# Altium schematic sheet 5min_DIP.SchDoc
size A3; PageSetup: Record=PageOptions|CenterHorizontal=True|CenterVertical=True|PrintScale=1.00|XCorrection=1.00|YCorrection=1.00|PrintKind=1|BorderSize=5000000|LeftOffset=0|BottomOffset=0|Orientation=2|PaperLength=1000|PaperWidth=1000|Scale=100|PaperSource=7|PrintQuality=-4|MediaType=1|DitherType=10|PaperKind=A3|PrintScaleMode=1
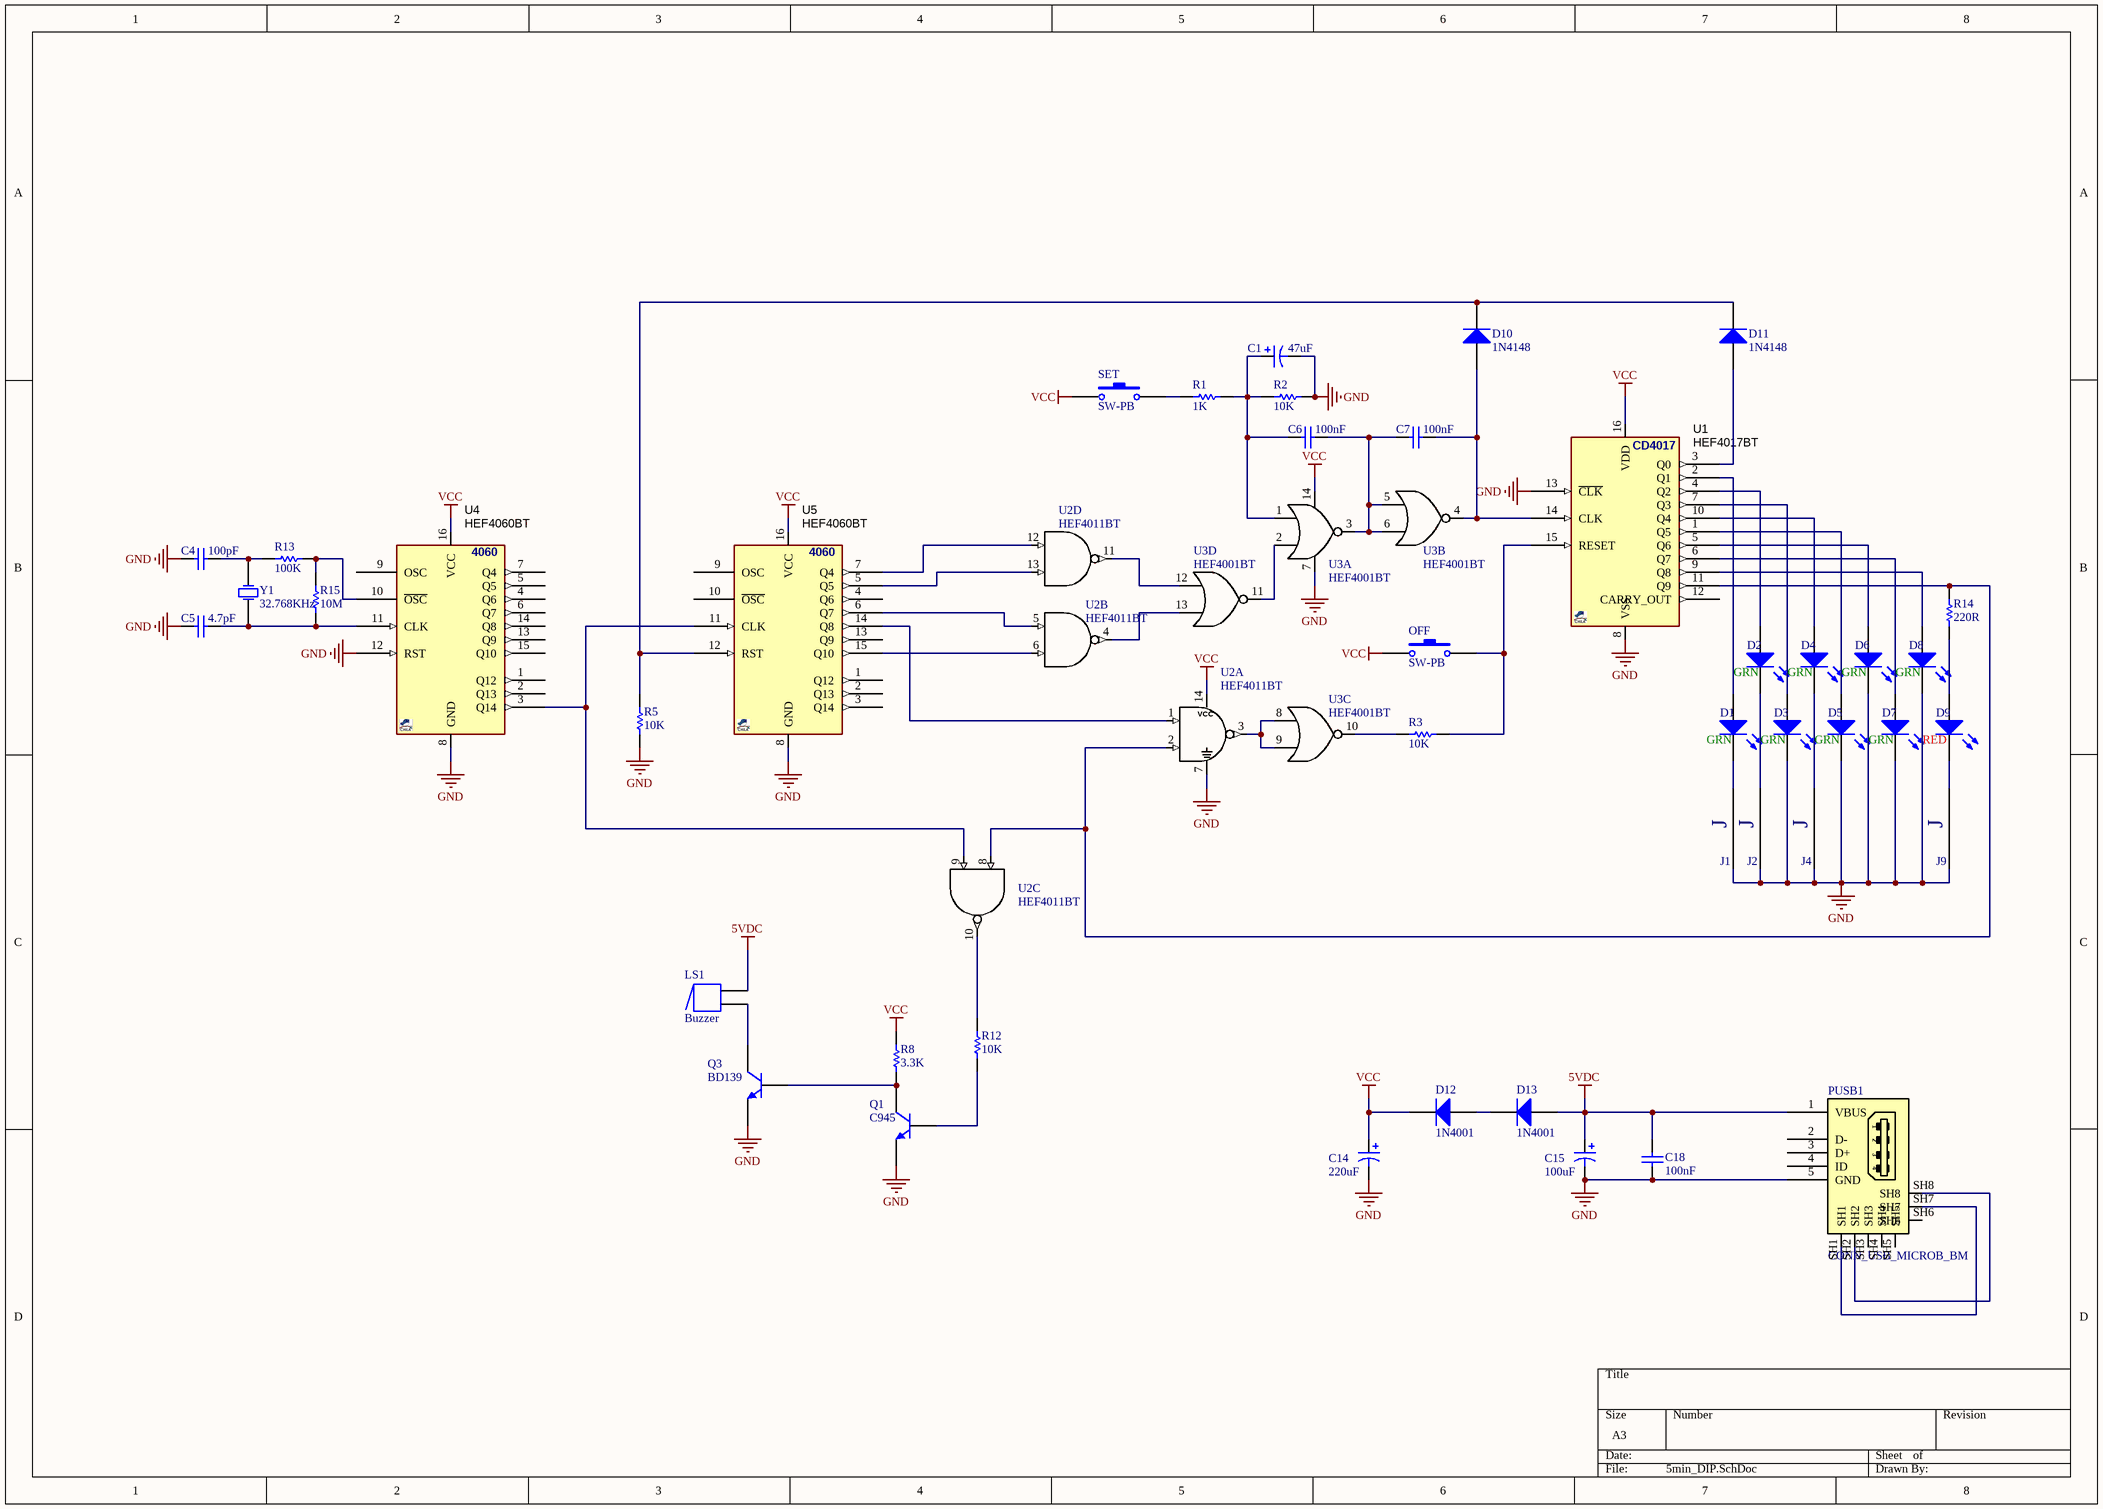
[diagram p0: 5min_DIP.SchDoc]

## Parts
C1  value 47uF  [A]  (hidden comment: Cap Pol1)
C4  value 100pF  [CAP100N]  (hidden comment: Cap)
C5  value 4.7pF  [CAP100N]  (hidden comment: Cap)
C6  value 100nF  [CAP100N]  (hidden comment: Cap)
C7  value 100nF  [CAP100N]  (hidden comment: Cap)
C14  value 220uF  [A]  (hidden comment: Cap Pol1)
C15  value 100uF  [A]  (hidden comment: Cap Pol1)
C18  value 100nF  [CAP100N]  (hidden comment: Cap)
D1  GRN  [LED3MM]
D2  GRN  [LED3MM]
D3  GRN  [LED3MM]
D4  GRN  [LED3MM]
D5  GRN  [LED3MM]
D6  GRN  [LED3MM]
D7  GRN  [LED3MM]
D8  GRN  [LED3MM]
D9  RED  [LED3MM]
D10  1N4148  [D_LN]
D11  1N4148  [D_LN]
D12  1N4001  [DO-35]
D13  1N4001  [DO-35]
J1  Jumper  [JMP]  (value not drawn)
J2  Jumper  [JMP]  (value not drawn)
J4  Jumper  [JMP]  (value not drawn)
J9  Jumper  [JMP]  (value not drawn)
LS1  Buzzer  [ABSM-1574]
OFF  SW-PB  [BUTTN]
PUSB1  CONN_USB_MICROB_BM  [USB_MICRO_AB_BM_SHS]
Q1  C945  [TO-92]
Q3  BD139  [BD139]
R1  value 1K  [AXIAL-0.3]  (hidden comment: Res1)
R2  value 10K  [AXIAL-0.3]  (hidden comment: Res1)
R3  value 10K  [AXIAL-0.3]  (hidden comment: Res1)
R5  value 10K  [AXIAL-0.3]  (hidden comment: Res1)
R8  value 3.3K  [AXIAL-0.3]  (hidden comment: Res1)
R12  value 10K  [AXIAL-0.3]  (hidden comment: Res1)
R13  value 100K  [AXIAL-0.3]  (hidden comment: Res1)
R14  value 220R  [AXIAL-0.3]  (hidden comment: Res1)
R15  value 10M  [AXIAL-0.3]  (hidden comment: Res1)
SET  SW-PB  [BUTTN]
U1  HEF4017BT  [DIP_16]
U2  HEF4011BT  [DIP_14]  (parts A,B,C,D of 4)
U3  HEF4001BT  [DIP_14]  (parts A,B,C,D of 4)
U4  HEF4060BT  [DIP_16]
U5  HEF4060BT  [DIP_16]
Y1  value 32.768KHz  [XTAL]  (hidden comment: ECS-040-20-4X-DU)

## Nets
5VDC: C15.1 C18.2 D13.1(A) LS1.1 PUSB1.1(VBUS)
GND: C1.2 C4.1 C5.1 C14.2 C15.2 C18.1 D3.2(K) D5.2(K) D6.2(K) D7.2(K) D8.2(K) J1.1 J2.1 J4.1 J9.1 PUSB1.5(GND) Q1.3(E) Q3.3(E) R2.2 R5.2 U1.8(VSS) U1.13(~{CLK}) U2.7(GND) U3.7(GND) U4.8(GND) U4.12(RST) U5.8(GND)
VCC: C14.1 D12.2(K) OFF.1 R8.2 SET.2 U1.16(VDD) U2.14(VDD) U3.14(VCC) U4.16(VCC) U5.16(VCC)
NetC1_1: C1.1 C6.1 R1.2 R2.1 U3.1
NetC4_2: C4.2 R13.1 Y1.1(OSC1)
NetC5_2: C5.2 R15.1 U4.11(CLK) Y1.2(OSC2)
NetC6_2: C6.2 C7.1 U3.3 U3.5 U3.6
NetC7_2: C7.2 D10.1(A) U1.14(CLK) U3.4
NetD1_1: D1.1(A) U1.2(Q1)
NetD1_2: D1.2(K) J1.2
NetD2_1: D2.1(A) U1.4(Q2)
NetD2_2: D2.2(K) J2.2
NetD3_1: D3.1(A) U1.7(Q3)
NetD4_1: D4.1(A) U1.10(Q4)
NetD4_2: D4.2(K) J4.2
NetD5_1: D5.1(A) U1.1(Q5)
NetD6_1: D6.1(A) U1.5(Q6)
NetD7_1: D7.1(A) U1.6(Q7)
NetD8_1: D8.1(A) U1.9(Q8)
NetD9_1: D9.1(A) R14.1
NetD9_2: D9.2(K) J9.2
NetD10_2: D10.2(K) D11.2(K) R5.1 U5.12(RST)
NetD11_1: D11.1(A) U1.3(Q0)
NetD12_1: D12.1(A) D13.2(K)
NetLS1_2: LS1.2 Q3.1(C)
NetOFF_2: OFF.2 R3.2 U1.15(RESET)
NetPUSB1_SH1: PUSB1.SH1 PUSB1.SH7
NetPUSB1_SH2: PUSB1.SH2 PUSB1.SH8
NetQ1_1: Q1.1(C) Q3.2(B) R8.1
NetQ1_2: Q1.2(B) R12.2
NetR1_1: R1.1 SET.1
NetR3_1: R3.1 U3.10
NetR12_1: R12.1 U2.10(J)
NetR13_2: R13.2 R15.2 U4.10(~{OSC})
NetR14_2: R14.2 U1.11(Q9) U2.2(B) U2.8(A)
NetU2_1: U2.1(A) U5.14(Q8)
NetU2_3: U2.3(J) U3.8 U3.9
NetU2_4: U2.4(J) U3.13
NetU2_5: U2.5(A) U5.6(Q7)
NetU2_6: U2.6(B) U5.15(Q10)
NetU2_9: U2.9(F) U4.3(Q14) U5.11(CLK)
NetU2_11: U2.11(J) U3.12
NetU2_12: U2.12(A) U5.7(Q4)
NetU2_13: U2.13(B) U5.5(Q5)
NetU3_2: U3.2 U3.11

Not connected (* = marked no-connect by the designer): PUSB1 2(D-) 3(D+) 4(ID) SH3 SH4 SH5 SH6; U1 12(CARRY_OUT); U4 1(Q12) 2(Q13) 4(Q6) 5(Q5) 6(Q7) 7(Q4) 9(OSC) 13(Q9) 14(Q8) 15(Q10); U5 1(Q12) 2(Q13) 3(Q14) 4(Q6) 9(OSC) 10(~{OSC}) 13(Q9)

## Notes on the sheet
- (in symbol CD4017_DIP16) CD4017
- (in symbol CD4060_DIP16) 4060
- (in symbol Jumper) J
- (in symbol NANDx4_CD4011BCM, part A) VCC

## Library data of the parts
C1 C14 C15 = Cap Pol1: Polarized Capacitor (Radial); Published: 8-Jun-2000; LatestRevisionDate: 17-Jul-2002; LatestRevisionNote: Re-released for DXP Platform.; PackageReference: RB7.6-15; Publisher: Altium Limited
C4-C7 C18 = Cap: Capacitor; Published: 8-Jun-2000; LatestRevisionDate: 17-Jul-2002; LatestRevisionNote: Re-released for DXP Platform.; PackageReference: RAD-0.3; Publisher: Altium Limited
D1-D9 = LED0: Typical INFRARED GaAs LED; Published: 8-Jun-2000; LatestRevisionDate: 08-Jul-2005; LatestRevisionNote: Mech Layer 1 removed.; PackageReference: LED-0; Publisher: Altium Limited
D10-D13 = Diode 1N4148: High Conductance Fast Diode; Published: 8-Jun-2000; LatestRevisionDate: 17-Jul-2002; LatestRevisionNote: Re-released for DXP Platform.; DatasheetDocument: 1997; PackageReference: DO-35; Publisher: Altium Limited; Code_JEDEC: DO-204-AH; ComponentLink1Description: Manufacturer Link; ComponentLink1URL: http://www.fairchildsemi.com/; ComponentLink2Description: Datasheet; ComponentLink2URL: http://www.fairchildsemi.com/ds/1N%2F1N4148.pdf
LS1 = Buzzer: Magnetic Transducer Buzzer; Published: 24-Mar-1999; LatestRevisionDate: 17-Dec-2003; LatestRevisionNote: Schematic revised, PCB Footprint replaced.; DatasheetDocument: 17-Dec-2003; PackageReference: ABSM-1574; Publisher: Altium Limited; ComponentLink1Description: Manufacturer Link; ComponentLink1URL: http://www.megastar.com/linecard/buzzmode/index.php
OFF SET = SW-PB: Switch; Published: 24-Mar-1999; LatestRevisionDate: 17-Jul-2002; LatestRevisionNote: Re-released for DXP Platform.; PackageReference: SPST-2; Publisher: Altium Limited
PUSB1 = CONN_USB_MICRO_AB_BM_SHS: CONN, USB, MICRO AB, R/A, SMD, BOTTOM MOUNT; MANF_P#: 1981584-1; MANF: TE; PARAM2: 30VAC; PARAM: 1.8A, -30~85oC; MANF_P#2: HIROSE ZX62-AB-5PA; PRICE: 0.75$; VALUE: CONN_USB_MICROB_BM
Q1 Q3 = NPN: NPN Bipolar Transistor; Published: 8-Jun-2000; LatestRevisionDate: 17-Jul-2002; LatestRevisionNote: Re-released for DXP Platform.; PackageReference: TO-226; Publisher: Altium Limited; Code_JEDEC: TO-226-AA
R1-R3 R5 R8 R12-R15 = Res1: Resistor; Published: 8-Jun-2000; LatestRevisionDate: 17-Jul-2002; LatestRevisionNote: Re-released for DXP Platform.; PackageReference: AXIAL-0.3; Publisher: Altium Limited
U1 = CD4017_DIP16: Counter, 10 decoded output; MANF: TI; MANF_P#: CD4017BE; PARAM2: 3~18V; PARAM: -55~125oC; PRICE: 0.5$
U2 = NANDx4_CD4011BCM: GATE, NAND, Quad 2-Input; MANF_P#: CD4011BCMA
U3 = NORx4_CD74HC02_DIP: Gate, NOR, Quad 2 Input; MANF: Texas Instruments; MANF_P#: CD74HC02E; PARAM2: 2~6V; PARAM: 5.2mA, 23ns
U4 U5 = CD4060_DIP16: Counter, 14-Bit Binary, 3~18v, 10mA; MANF: TI; MANF_P#: CD4060BE; PARAM2: 3~18v, -55~125oC; PARAM: 10mA; PRICE: 0.5$
Y1 = XTAL: Crystal Oscillator; Published: 8-Jun-2000; LatestRevisionDate: 17-Jul-2002; LatestRevisionNote: Re-released for DXP Platform.; PackageReference: R38; Publisher: Altium Limited; PackageDescription: Crystal, Thru-Hole; 2 Leads; Body 3.1 x 8.2 mm (Dia.xH)